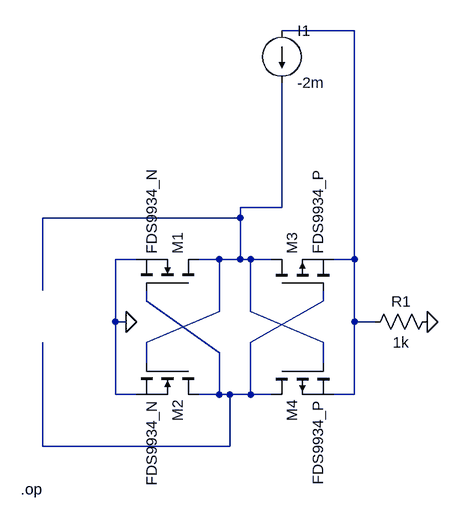
[diagram p0: schematic Draft2.asc]
Draft2.asc, the LTspice schematic file:
Version 4
SHEET 1 880 680
WIRE 400 -240 288 -240
WIRE 288 32 288 -160
WIRE 288 32 224 32
WIRE 224 48 224 32
WIRE 224 48 -80 48
WIRE 64 112 32 112
WIRE 192 112 160 112
WIRE 224 112 224 48
WIRE 224 112 192 112
WIRE 240 112 224 112
WIRE 272 112 240 112
WIRE 400 112 400 -240
WIRE 400 112 368 112
WIRE -80 160 -80 48
WIRE 80 176 80 160
WIRE 352 176 352 160
WIRE 192 192 192 112
WIRE 240 192 240 112
WIRE 32 208 32 112
WIRE 48 208 32 208
WIRE 400 208 400 112
WIRE 432 208 400 208
WIRE 80 240 192 192
WIRE 240 240 352 176
WIRE 352 240 240 192
WIRE 192 256 80 176
WIRE 80 272 80 240
WIRE 352 272 352 240
WIRE 32 320 32 208
WIRE 64 320 32 320
WIRE 192 320 192 256
WIRE 192 320 160 320
WIRE 208 320 192 320
WIRE 240 320 240 240
WIRE 240 320 208 320
WIRE 272 320 240 320
WIRE 400 320 400 208
WIRE 400 320 368 320
WIRE -80 400 -80 240
WIRE 208 400 208 320
WIRE 208 400 -80 400
FLAG 48 208 0
FLAG 512 208 0
SYMBOL nmos 160 160 M270
SYMATTR InstName M1
SYMATTR Value FDS9934_N
SYMBOL nmos 160 272 R90
SYMATTR InstName M2
SYMATTR Value FDS9934_N
SYMBOL pmos 272 160 R270
SYMATTR InstName M3
SYMATTR Value FDS9934_P
SYMBOL pmos 272 272 M90
SYMATTR InstName M4
SYMATTR Value FDS9934_P
SYMBOL res 528 192 R90
WINDOW 0 0 56 VBottom 2
WINDOW 3 32 56 VTop 2
SYMATTR InstName R1
SYMATTR Value 1k
SYMBOL current 288 -240 R0
WINDOW 123 0 0 Left 2
WINDOW 39 0 0 Left 2
SYMATTR InstName I1
SYMATTR Value -2m
TEXT -114 466 Left 2 !.op

The netlist it stands for:
* Draft2.asc
M1 N002 N003 0 0 FDS9934_N
M2 N003 N002 0 0 FDS9934_N
M3 N002 N003 N001 N001 FDS9934_P
M4 N003 N002 N001 N001 FDS9934_P
R1 0 N001 1k
I1 N001 N002 -2m
.model NMOS NMOS
.model PMOS PMOS
.lib standard.mos
.op
.backanno
.end